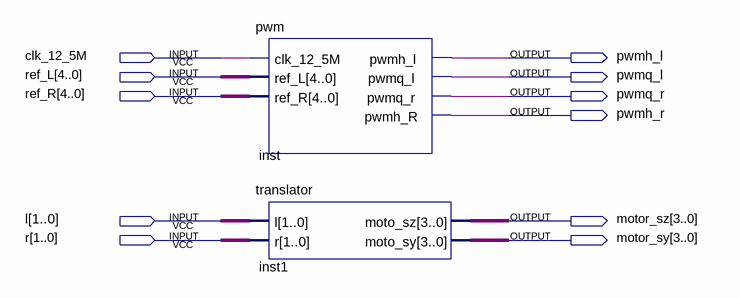
[diagram p0: schematic sheet]
// Quartus schematic motor_control.bdf as structural Verilog: 2 symbols, 11 pins
module motor_control (
  input  clk_12_5M,
  input  [4:0] ref_L,
  input  [4:0] ref_R,
  input  [1:0] l,
  input  [1:0] r,
  output pwmh_l,
  output pwmq_l,
  output pwmq_r,
  output pwmh_r,
  output [3:0] motor_sz,
  output [3:0] motor_sy
);

  pwm inst (
    .clk_12_5M(clk_12_5M), .ref_L(ref_L), .ref_R(ref_R), .pwmh_l(pwmh_l), .pwmq_l(pwmq_l), .pwmq_r(pwmq_r),
    .pwmh_R(pwmh_r));
  translator inst1 (.l(l), .r(r), .moto_sz(motor_sz), .moto_sy(motor_sy));
endmodule
